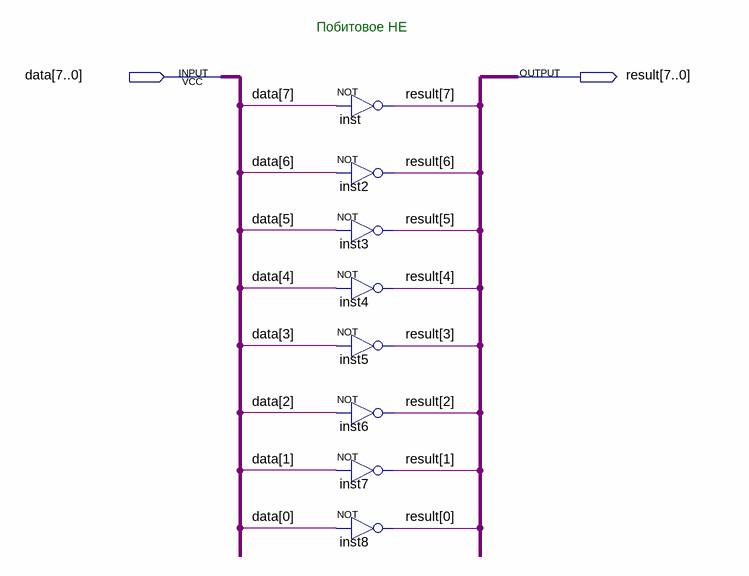
[diagram p0: schematic sheet]
// Quartus schematic alu_logic_not8.bdf as structural Verilog: 8 symbols, 2 pins
module alu_logic_not8 (
  input  [7:0] data,
  output [7:0] result
);

  not inst (result[7], data[7]);
  not inst2 (result[6], data[6]);
  not inst3 (result[5], data[5]);
  not inst4 (result[4], data[4]);
  not inst5 (result[3], data[3]);
  not inst6 (result[2], data[2]);
  not inst7 (result[1], data[1]);
  not inst8 (result[0], data[0]);

  // Notes on the sheet:
  //   Побитовое НЕ
endmodule
